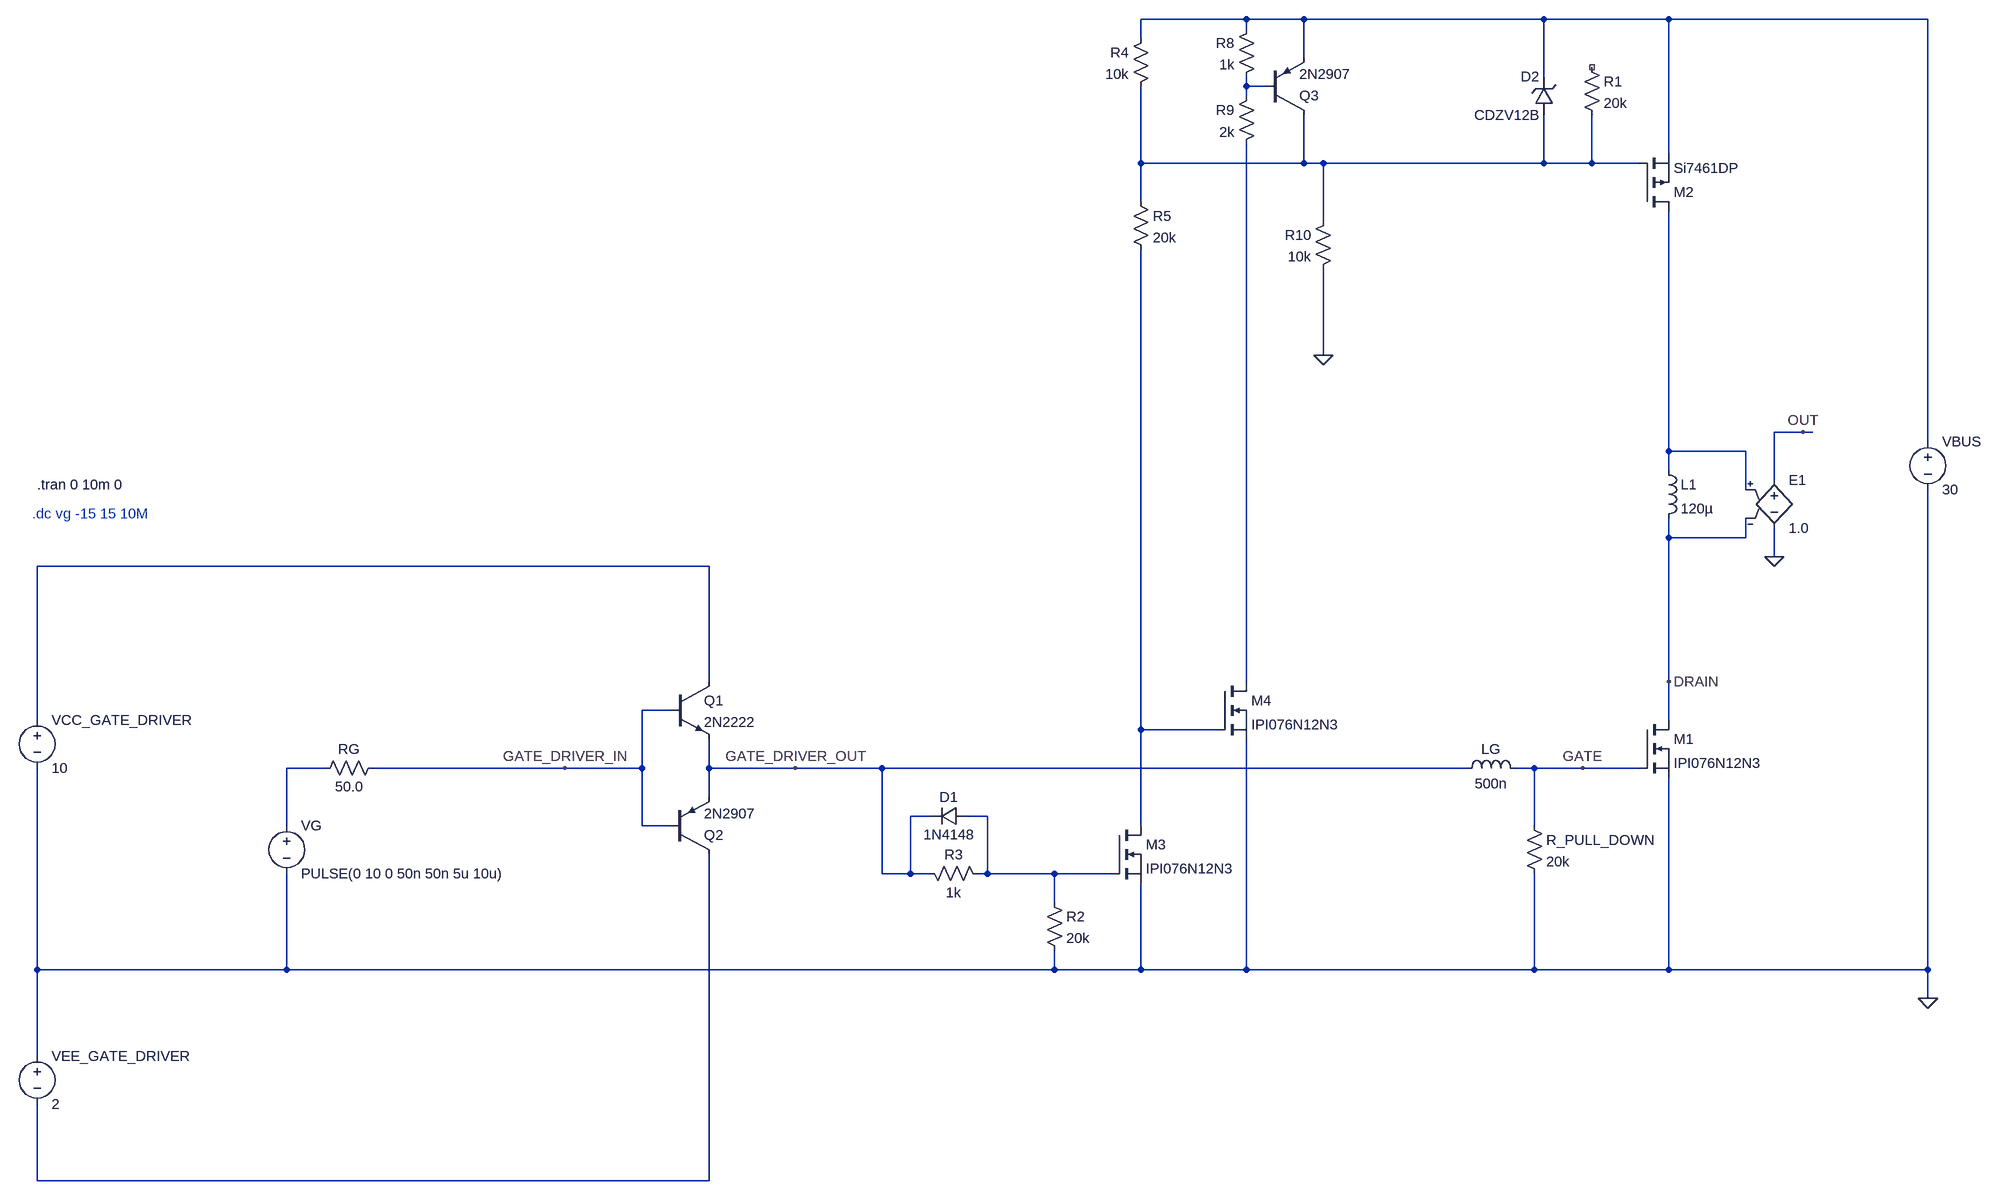
[diagram p0: schematic Push_Pull_Gate_Driver_Simulation.asc]
Push_Pull_Gate_Driver_Simulation.asc, the LTspice schematic file:
Version 4.1
SHEET 1 2380 948
WIRE 1152 -992 976 -992
WIRE 1248 -992 1152 -992
WIRE 1648 -992 1248 -992
WIRE 1856 -992 1648 -992
WIRE 2288 -992 1856 -992
WIRE 1152 -976 1152 -992
WIRE 976 -960 976 -992
WIRE 1248 -928 1248 -992
WIRE 1648 -896 1648 -992
WIRE 1152 -880 1152 -896
WIRE 1184 -880 1152 -880
WIRE 1152 -864 1152 -880
WIRE 1856 -768 1856 -992
WIRE 976 -752 976 -880
WIRE 1248 -752 1248 -832
WIRE 1248 -752 976 -752
WIRE 1280 -752 1248 -752
WIRE 1648 -752 1648 -832
WIRE 1648 -752 1280 -752
WIRE 1728 -752 1728 -832
WIRE 1728 -752 1648 -752
WIRE 1808 -752 1728 -752
WIRE 976 -688 976 -752
WIRE 1280 -656 1280 -752
WIRE 1280 -432 1280 -576
WIRE 2080 -304 2032 -304
WIRE 2096 -304 2080 -304
WIRE 2288 -288 2288 -992
WIRE 1856 -272 1856 -672
WIRE 1984 -272 1856 -272
WIRE 1856 -240 1856 -272
WIRE 2032 -224 2032 -304
WIRE 1984 -208 1984 -272
WIRE 1856 -128 1856 -160
WIRE 1984 -128 1984 -160
WIRE 1984 -128 1856 -128
WIRE 2032 -96 2032 -144
WIRE 256 -80 -864 -80
WIRE 256 112 256 -80
WIRE 1152 112 1152 -784
WIRE 1856 112 1856 -128
WIRE 192 160 144 160
WIRE -864 176 -864 -80
WIRE 1856 176 1856 112
WIRE 976 192 976 -608
WIRE 1104 192 976 192
WIRE -384 256 -448 256
WIRE 16 256 -304 256
WIRE 144 256 144 160
WIRE 144 256 16 256
WIRE 256 256 256 208
WIRE 400 256 256 256
WIRE 544 256 400 256
WIRE 1520 256 544 256
WIRE 1632 256 1600 256
WIRE 1712 256 1632 256
WIRE 1808 256 1712 256
WIRE 256 304 256 256
WIRE 624 336 592 336
WIRE 720 336 688 336
WIRE -448 352 -448 256
WIRE 144 352 144 256
WIRE 192 352 144 352
WIRE 976 352 976 192
WIRE 1632 352 1632 256
WIRE 544 432 544 256
WIRE 592 432 592 336
WIRE 592 432 544 432
WIRE 624 432 592 432
WIRE 720 432 720 336
WIRE 720 432 704 432
WIRE 832 432 720 432
WIRE 928 432 832 432
WIRE 832 480 832 432
WIRE -864 592 -864 256
WIRE -448 592 -448 432
WIRE -448 592 -864 592
WIRE 832 592 832 560
WIRE 832 592 -448 592
WIRE 976 592 976 448
WIRE 976 592 832 592
WIRE 1152 592 1152 208
WIRE 1152 592 976 592
WIRE 1632 592 1632 432
WIRE 1632 592 1152 592
WIRE 1856 592 1856 272
WIRE 1856 592 1632 592
WIRE 2288 592 2288 -208
WIRE 2288 592 1856 592
WIRE 2288 640 2288 592
WIRE -864 736 -864 592
WIRE -864 944 -864 816
WIRE 256 944 256 400
WIRE 256 944 -864 944
FLAG 2288 640 0
FLAG 1712 256 GATE
FLAG 1856 112 DRAIN
FLAG 400 256 GATE_DRIVER_OUT
FLAG 16 256 GATE_DRIVER_IN
FLAG 1280 -432 0
FLAG 2032 -96 0
FLAG 2080 -304 OUT
SYMBOL npn 192 112 R0
SYMATTR InstName Q1
SYMATTR Value 2N2222
SYMBOL pnp 192 400 M180
SYMATTR InstName Q2
SYMATTR Value 2N2907
SYMBOL nmos 1808 176 R0
SYMATTR InstName M1
SYMATTR Value IPI076N12N3
SYMBOL voltage 2288 -304 R0
WINDOW 123 0 0 Left 0
WINDOW 39 0 0 Left 0
SYMATTR InstName VBUS
SYMATTR Value 30
SYMBOL voltage -864 160 R0
WINDOW 123 0 0 Left 0
WINDOW 39 0 0 Left 0
SYMATTR InstName VCC_GATE_DRIVER
SYMATTR Value 10
SYMBOL voltage -448 336 R0
WINDOW 123 0 0 Left 0
WINDOW 39 0 0 Left 0
SYMATTR InstName VG
SYMATTR Value PULSE(0 10 0 50n 50n 5u 10u)
SYMBOL res -400 272 R270
WINDOW 0 32 56 VTop 2
WINDOW 3 0 56 VBottom 2
SYMATTR InstName RG
SYMATTR Value 50.0
SYMBOL ind 1504 272 R270
WINDOW 0 32 56 VTop 2
WINDOW 3 5 56 VBottom 2
SYMATTR InstName LG
SYMATTR Value 500n
SYMATTR SpiceLine Rser=1m
SYMBOL res 1616 336 R0
SYMATTR InstName R_PULL_DOWN
SYMATTR Value 20k
SYMBOL voltage -864 720 R0
WINDOW 123 0 0 Left 0
WINDOW 39 0 0 Left 0
SYMATTR InstName VEE_GATE_DRIVER
SYMATTR Value 2
SYMBOL pmos 1808 -672 M180
SYMATTR InstName M2
SYMATTR Value Si7461DP
SYMBOL res 1712 -928 R0
SYMATTR InstName R1
SYMATTR Value 20k
SYMBOL res 608 416 M90
WINDOW 0 0 56 VBottom 2
WINDOW 3 32 56 VTop 2
SYMATTR InstName R3
SYMATTR Value 1k
SYMBOL diode 688 320 R90
WINDOW 0 0 32 VBottom 2
WINDOW 3 32 32 VTop 2
SYMATTR InstName D1
SYMATTR Value 1N4148
SYMBOL res 992 -976 M0
SYMATTR InstName R4
SYMATTR Value 10k
SYMBOL res 960 -704 R0
SYMATTR InstName R5
SYMATTR Value 20k
SYMBOL zener 1664 -832 R180
WINDOW 0 24 64 Left 2
WINDOW 3 24 0 Left 2
SYMATTR InstName D2
SYMATTR Value CDZV12B
SYMBOL nmos 928 352 R0
SYMATTR InstName M3
SYMATTR Value IPI076N12N3
SYMBOL res 816 464 R0
SYMATTR InstName R2
SYMATTR Value 20k
SYMBOL nmos 1104 112 R0
SYMATTR InstName M4
SYMATTR Value IPI076N12N3
SYMBOL pnp 1184 -832 M180
SYMATTR InstName Q3
SYMATTR Value 2N2907
SYMBOL res 1168 -992 M0
SYMATTR InstName R8
SYMATTR Value 1k
SYMBOL res 1168 -880 M0
SYMATTR InstName R9
SYMATTR Value 2k
SYMBOL res 1296 -672 M0
SYMATTR InstName R10
SYMATTR Value 10k
SYMBOL e 2032 -240 R0
SYMATTR InstName E1
SYMATTR Value 1.0
SYMBOL ind 1840 -256 R0
SYMATTR InstName L1
SYMATTR Value 120µ
SYMATTR SpiceLine Rser=1m
TEXT -864 -216 Left 2 !.tran 0 10m 0
TEXT -872 -168 Left 2 ;.dc vg -15 15 10M

The netlist it stands for:
* Push_Pull_Gate_Driver_Simulation.asc
Q1 N005 GATE_DRIVER_IN GATE_DRIVER_OUT 0 2N2222
Q2 N010 GATE_DRIVER_IN GATE_DRIVER_OUT 0 2N2907
M1 DRAIN GATE 0 0 IPI076N12N3
VBUS N001 0 30
VCC_GATE_DRIVER N005 0 10
VG N008 0 PULSE(0 10 0 50n 50n 5u 10u)
RG N008 GATE_DRIVER_IN 50.0
LG GATE_DRIVER_OUT GATE 500n Rser=1m
R_PULL_DOWN GATE 0 20k
VEE_GATE_DRIVER 0 N010 2
M2 N004 N003 N001 N001 Si7461DP
R1 NC_01 N003 20k
R3 GATE_DRIVER_OUT N009 1k
D1 N009 GATE_DRIVER_OUT 1N4148
R4 N001 N003 10k
R5 N003 N007 20k
D2 N003 N001 CDZV12B
M3 N007 N009 0 0 IPI076N12N3
R2 N009 0 20k
M4 N006 N007 0 0 IPI076N12N3
Q3 N003 N002 N001 0 2N2907
R8 N001 N002 1k
R9 N002 N006 2k
R10 N003 0 10k
E1 OUT 0 N004 DRAIN 1.0
L1 N004 DRAIN 120µ Rser=1m
.model D D
.lib standard.dio
.model NPN NPN
.model PNP PNP
.lib standard.bjt
.model NMOS NMOS
.model PMOS PMOS
.lib standard.mos
.tran 0 10m 0
* .dc vg -15 15 10M
.backanno
.end